# Altium schematic sheet TPS5450DDA_2022-06-29.schdoc
size 54 x 37 mm
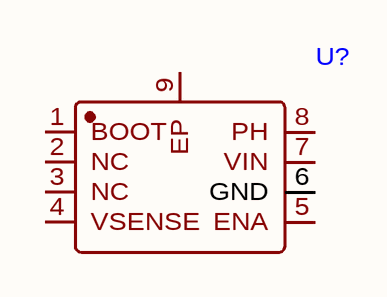
[diagram p0: TPS5450DDA_2022-06-29.schdoc]

## Parts
U?  (no value)  [SOP-8_L4.9-W3.9-P1.27-LS6.0-TL-EP-1]

## Nets

Not connected (* = marked no-connect by the designer): U? 1(BOOT) 2(NC) 3(NC) 4(VSENSE) 5(ENA) 6(GND) 7(VIN) 8(PH) 9(EP)

## Library data of the parts
U? = TPS5450DDA